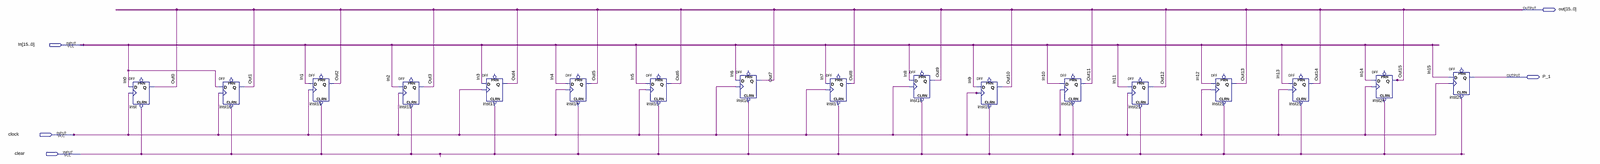
[diagram p0: schematic sheet, whole]
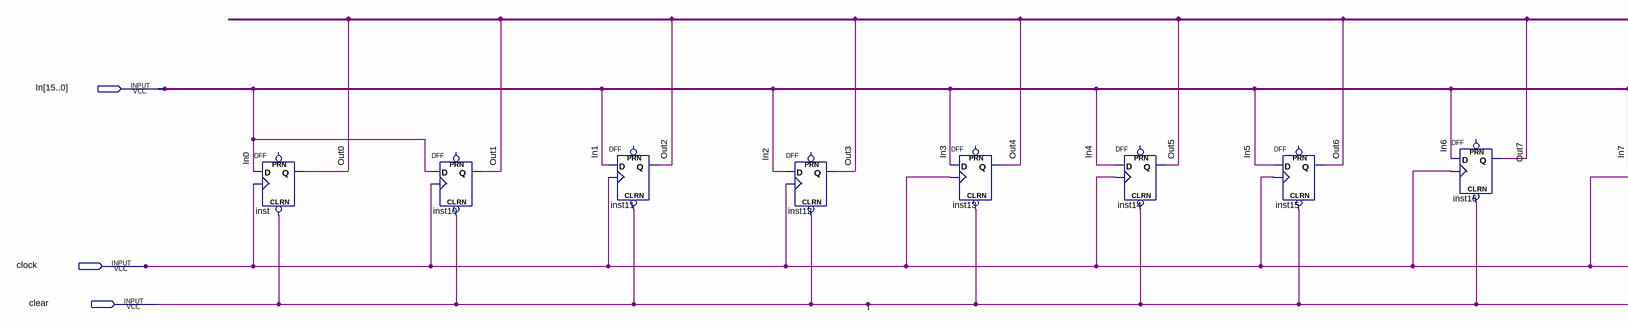
[diagram p1: schematic sheet, left part]
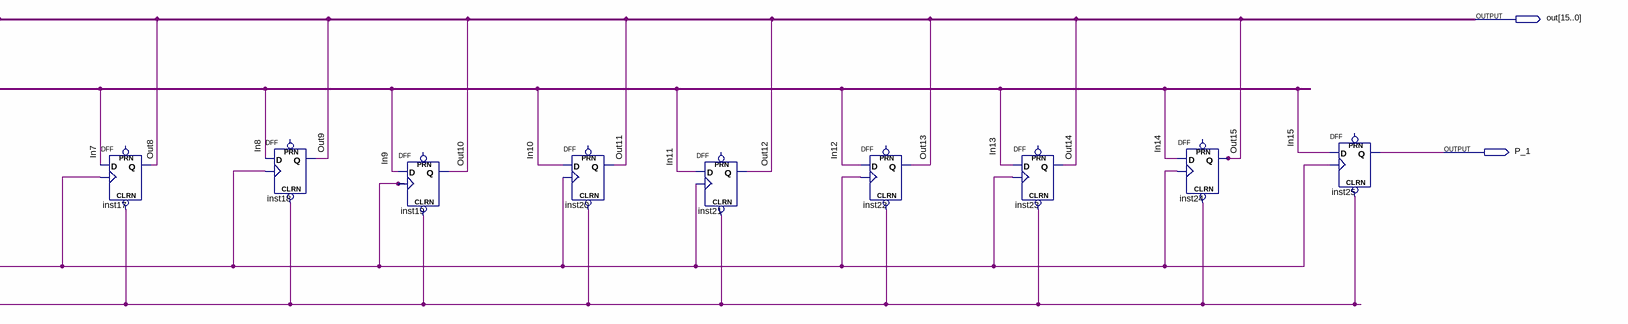
[diagram p2: schematic sheet, right part]
// Quartus schematic parallelshift.bdf as structural Verilog: 17 symbols, 5 pins
module parallelshift (
  input  [15:0] In,
  input  clock,
  input  clear,
  output [15:0] out,
  output P_1
);

  DFF inst (.CLRN(clear), .CLK(clock), .D(In[0]), .Q(out[0]));  // open: PRN
  DFF inst10 (.CLRN(clear), .CLK(clock), .D(In[0]), .Q(out[1]));  // open: PRN
  DFF inst11 (.CLRN(clear), .CLK(clock), .D(In[1]), .Q(out[2]));  // open: PRN
  DFF inst12 (.CLRN(clear), .CLK(clock), .D(In[2]), .Q(out[3]));  // open: PRN
  DFF inst13 (.CLRN(clear), .CLK(clock), .D(In[3]), .Q(out[4]));  // open: PRN
  DFF inst14 (.CLRN(clear), .CLK(clock), .D(In[4]), .Q(out[5]));  // open: PRN
  DFF inst15 (.CLRN(clear), .CLK(clock), .D(In[5]), .Q(out[6]));  // open: PRN
  DFF inst16 (.CLRN(clear), .CLK(clock), .D(In[6]), .Q(out[7]));  // open: PRN
  DFF inst17 (.CLRN(clear), .CLK(clock), .D(In[7]), .Q(out[8]));  // open: PRN
  DFF inst18 (.CLRN(clear), .CLK(clock), .D(In[8]), .Q(out[9]));  // open: PRN
  DFF inst19 (.CLRN(clear), .CLK(clock), .D(In[9]), .Q(out[10]));  // open: PRN
  DFF inst20 (.CLRN(clear), .CLK(clock), .D(In[10]), .Q(out[11]));  // open: PRN
  DFF inst21 (.CLRN(clear), .CLK(clock), .D(In[11]), .Q(out[12]));  // open: PRN
  DFF inst22 (.CLRN(clear), .CLK(clock), .D(In[12]), .Q(out[13]));  // open: PRN
  DFF inst23 (.CLRN(clear), .CLK(clock), .D(In[13]), .Q(out[14]));  // open: PRN
  DFF inst24 (.CLRN(clear), .CLK(clock), .D(In[14]), .Q(out[15]));  // open: PRN
  DFF inst25 (.CLRN(clear), .CLK(clock), .D(In[15]), .Q(P_1));  // open: PRN
endmodule
